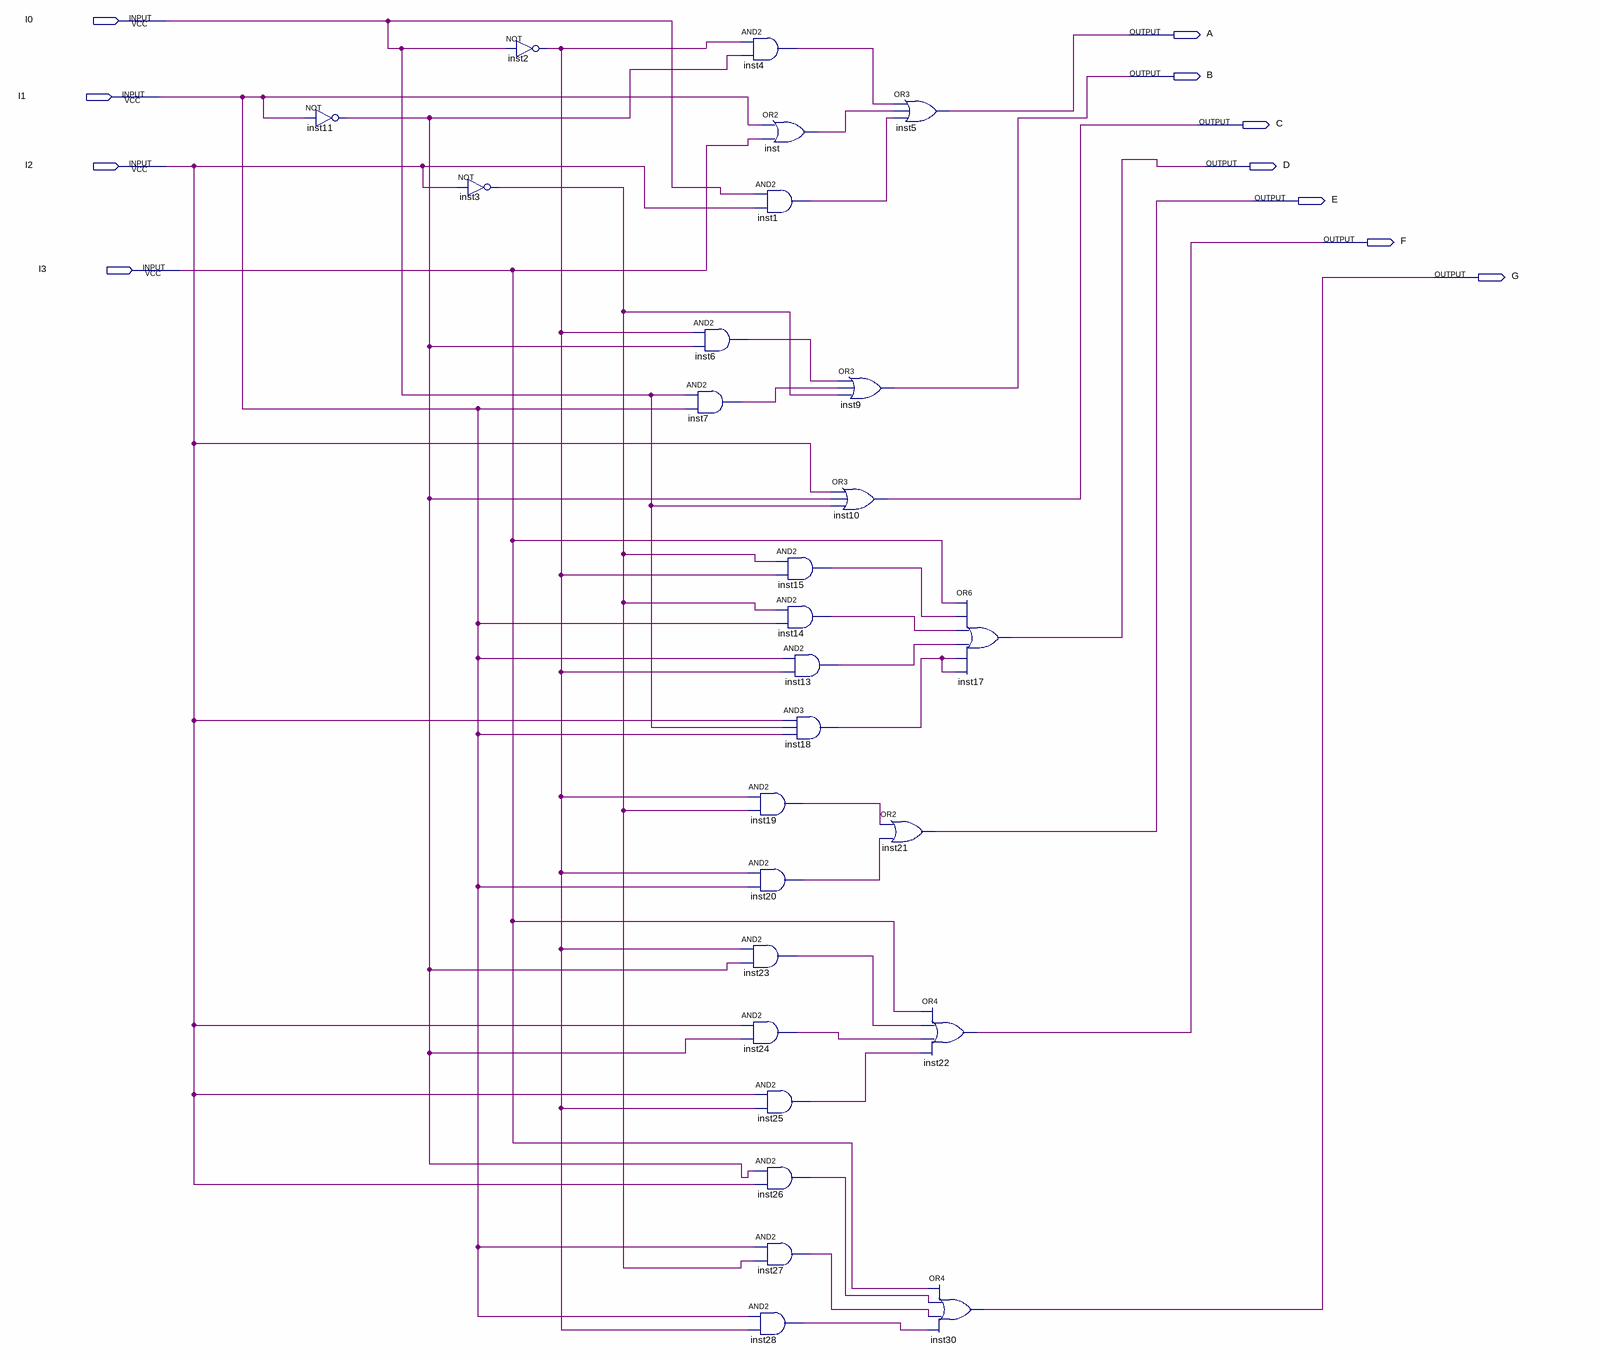
[diagram p0: schematic sheet]
// Quartus schematic decodificador_7segmento.bdf as structural Verilog: 27 symbols, 11 pins
module decodificador_7segmento (
  input  I0,
  input  I1,
  input  I2,
  input  I3,
  output A,
  output B,
  output C,
  output D,
  output E,
  output F,
  output G
);

  wire inst1_out, inst2_out, inst3_out, inst4_out, inst6_out, inst7_out, inst11_out, inst13_out, inst14_out,
       inst15_out, inst18_out, inst19_out, inst20_out, inst23_out, inst24_out, inst25_out, inst26_out,
       inst27_out, inst28_out, inst_out;

  not inst11 (inst11_out, I1);
  not inst3 (inst3_out, I2);
  not inst2 (inst2_out, I0);
  and inst6 (inst6_out, inst2_out, inst11_out);
  and inst7 (inst7_out, I0, I1);
  and inst4 (inst4_out, inst2_out, inst11_out);
  or inst (inst_out, I1, I3);
  and inst1 (inst1_out, I0, I2);
  and inst19 (inst19_out, inst2_out, inst3_out);
  and inst20 (inst20_out, inst2_out, I1);
  and inst23 (inst23_out, inst2_out, inst11_out);
  and inst24 (inst24_out, I2, inst11_out);
  and inst25 (inst25_out, I2, inst2_out);
  and inst26 (inst26_out, inst11_out, I2);
  and inst27 (inst27_out, I1, inst3_out);
  and inst28 (inst28_out, I1, inst2_out);
  and inst15 (inst15_out, inst3_out, inst2_out);
  and inst14 (inst14_out, inst3_out, I1);
  and inst13 (inst13_out, I1, inst2_out);
  and inst18 (inst18_out, I2, I0, I1);
  or inst9 (B, inst6_out, inst7_out, inst3_out);
  or inst10 (C, I2, inst11_out, I0);
  or inst21 (E, inst19_out, inst20_out);
  or inst5 (A, inst4_out, inst_out, inst1_out);
  or inst22 (F, I3, inst23_out, inst24_out, inst25_out);
  or inst30 (G, I3, inst26_out, inst27_out, inst28_out);
  or inst17 (D, I3, inst15_out, inst14_out, inst13_out, inst18_out, inst18_out);
endmodule
